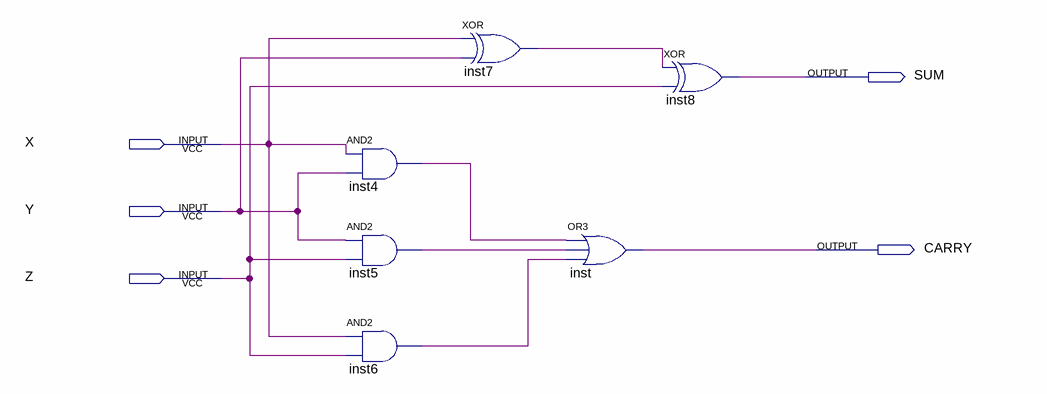
[diagram p0: schematic sheet]
// Quartus schematic full_adder.bdf as structural Verilog: 6 symbols, 5 pins
module full_adder (
  input  X,
  input  Y,
  input  Z,
  output SUM,
  output CARRY
);

  wire inst4_out, inst5_out, inst6_out, inst7_out;

  and inst4 (inst4_out, X, Y);
  and inst5 (inst5_out, Y, Z);
  and inst6 (inst6_out, X, Z);
  xor inst7 (inst7_out, X, Y);
  or inst (CARRY, inst4_out, inst5_out, inst6_out);
  xor inst8 (SUM, inst7_out, Z);
endmodule
